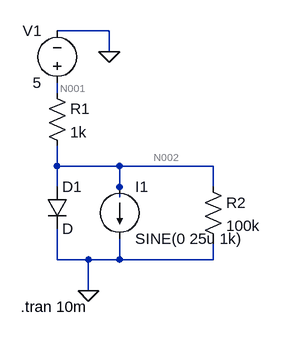
[diagram p0: schematic Draft2.asc]
Draft2.asc, the LTspice schematic file:
Version 4
SHEET 1 880 680
WIRE 256 -128 176 -128
WIRE 256 -96 256 -128
WIRE 176 -32 176 -48
WIRE 176 80 176 48
WIRE 272 80 176 80
WIRE 416 80 272 80
WIRE 176 112 176 80
WIRE 272 112 272 80
WIRE 416 112 416 80
WIRE 272 128 272 112
WIRE 176 224 176 176
WIRE 224 224 176 224
WIRE 272 224 272 192
WIRE 272 224 224 224
WIRE 416 224 416 192
WIRE 416 224 272 224
WIRE 224 272 224 224
FLAG 256 -96 0
FLAG 224 272 0
SYMBOL voltage 176 -32 R180
WINDOW 0 24 96 Left 2
WINDOW 3 24 16 Left 2
SYMATTR InstName V1
SYMATTR Value 5
SYMBOL res 160 -48 R0
SYMATTR InstName R1
SYMATTR Value 1k
SYMBOL res 400 96 R0
SYMATTR InstName R2
SYMATTR Value 100k
SYMBOL diode 160 112 R0
SYMATTR InstName D1
SYMBOL current 272 112 R0
WINDOW 123 0 0 Left 0
WINDOW 39 0 0 Left 0
SYMATTR InstName I1
SYMATTR Value SINE(0 25u 1k)
TEXT 120 296 Left 2 !.tran 10m

The netlist it stands for:
* Draft2.asc
V1 N001 0 5
R1 N001 N002 1k
R2 N002 0 100k
D1 N002 0 D
I1 N002 0 SINE(0 25u 1k)
.model D D
.lib standard.dio
.tran 10m
.backanno
.end

* Results of the author's LTspice run, read from the files saved beside the schematic
* Operating Point, zero values left out:
*   V(n001) = 5 V
*   V(n002) = 692.8 mV
*   I(D1) = 4.3 mA
*   I(R1) = 4.307 mA
*   I(R2) = 6.928 µA
*   I(V1) = -4.307 mA